# EAGLE schematic AstableMultivibrator-NPN-CapPol (EAGLE 7.2.0)
Forced quenching improves three-transistor FM tuner Lyle Williams -February 29, 2016 http://edn.com/design/diy/4441531/Forced-quenching-improves-three-transistor-FM-tuner
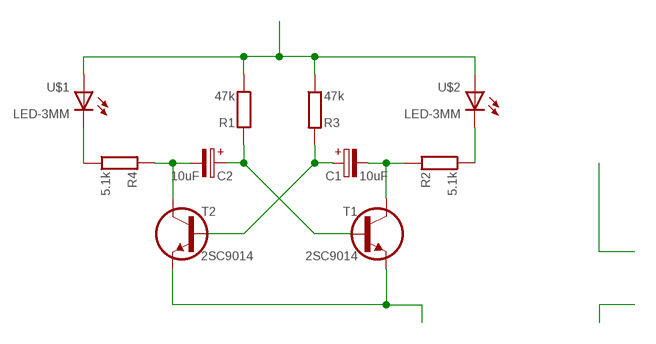
[diagram p0: schematic, sheet 1]

## Parts
C1  10uF  CPOL-HE2,5-4  [E2,5-4]
C2  10uF  CPOL-HE2,5-4  [E2,5-4]
R1  47k  R0202/7-V  [0202/7-V]
R2  5.1k  R0202/7-V  [0202/7-V]
R3  47k  R0202/7-V  [0202/7-V]
R4  5.1k  R0202/7-V  [0202/7-V]
T1  2SC9014  [TO92-EBC]
T2  2SC9014  [TO92-EBC]
U$1  LED-3MM  [LED_3MM]
U$2  LED-3MM  [LED_3MM]

## Nets
N$1: C2.- R4.2 T2.C
N$3: C2.+ R1.2 T1.B
N$4: C1.+ R3.2 T2.B
N$5: R1.1 R3.1 U$1.A U$2.A
N$6: T1.E T2.E
N$8: C1.- R2.2 T1.C
N$9: R4.1 U$1.K(C)
N$11: R2.1 U$2.K(C)

## Library data of the parts
C1 C2 = c:CPOL-H
R1-R4 = r:R: RESISTOR, European symbol
T1 T2 = t:2SC9014
U$1 U$2 = d:LED

## Net classes
0 default: width 0.61 mm